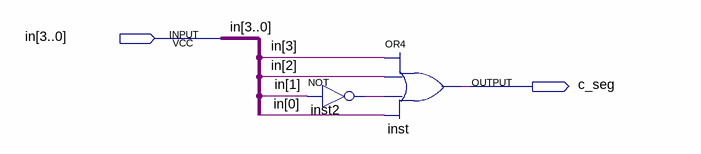
[diagram p0: schematic sheet]
// Quartus schematic c_seg.bdf as structural Verilog: 2 symbols, 2 pins
module c_seg (
  input  [3:0] in,
  output c_seg
);

  wire inst2_out;

  not inst2 (inst2_out, in[1]);
  or inst (c_seg, in[3], in[2], inst2_out, in[0]);
endmodule
